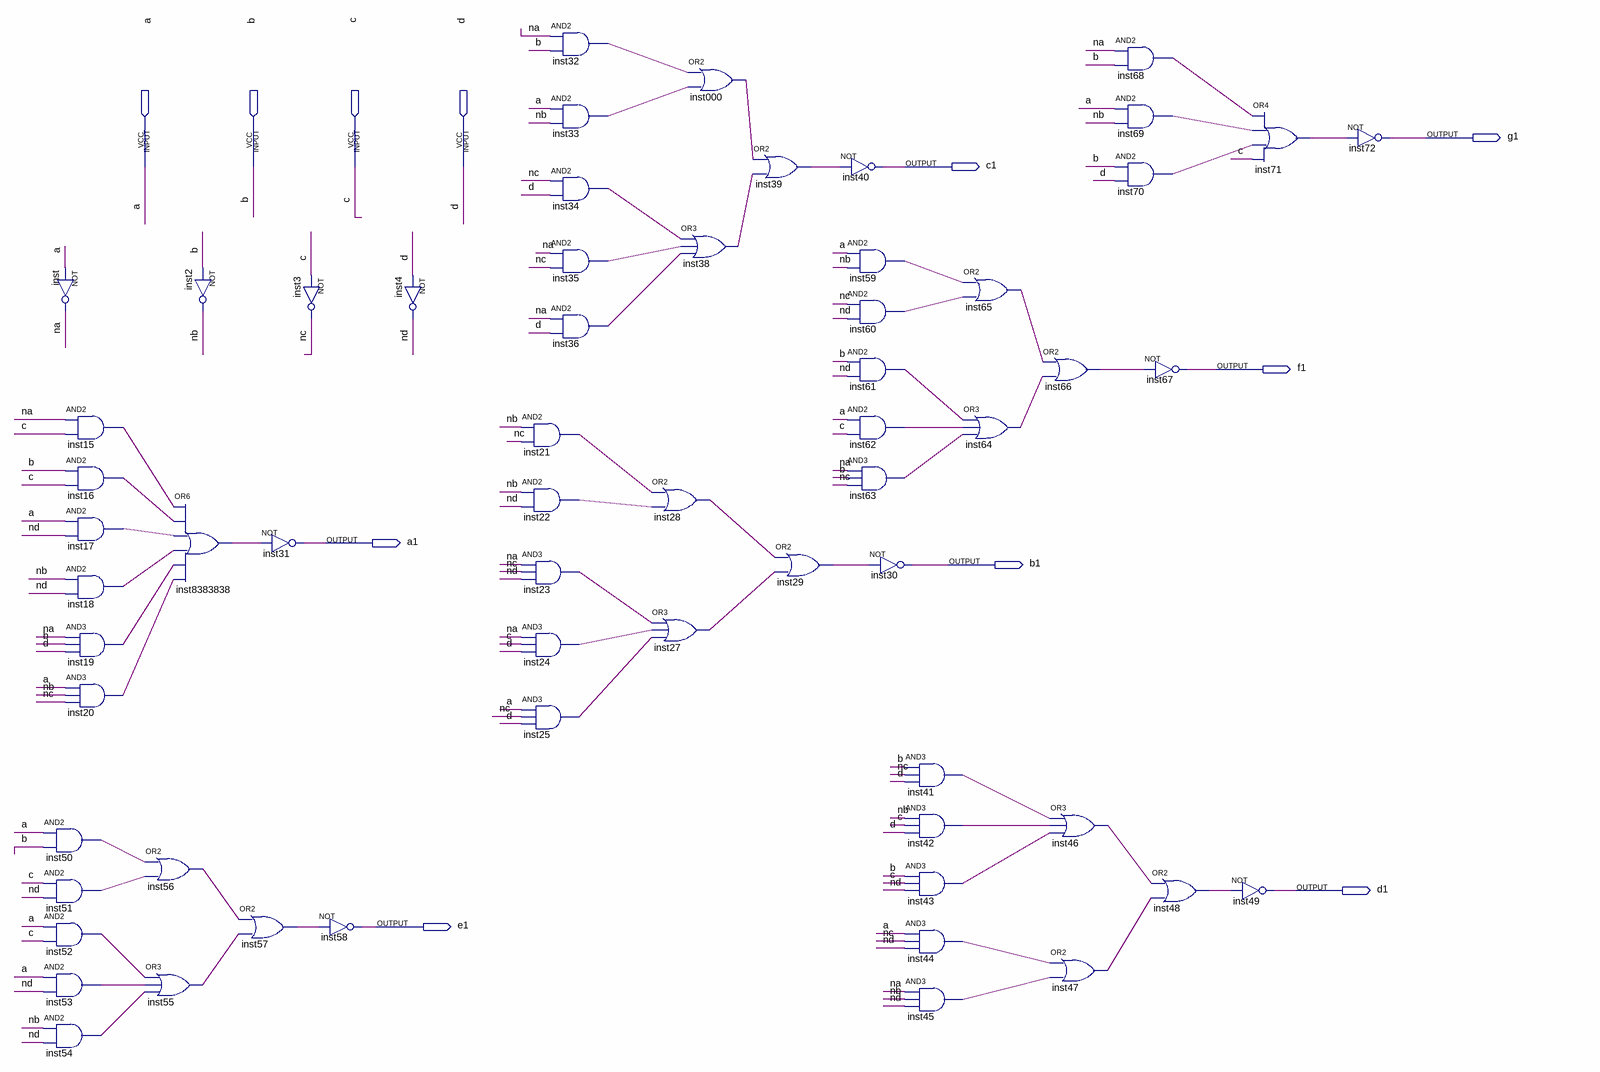
[diagram p0: schematic sheet]
// Quartus schematic Block1.bdf as structural Verilog: 62 symbols, 11 pins
module Block1 (
  input  a,
  input  b,
  input  c,
  input  d,
  output g1,
  output c1,
  output f1,
  output a1,
  output b1,
  output d1,
  output e1
);

  wire inst000_out, inst15_out, inst16_out, inst17_out, inst18_out, inst19_out, inst20_out, inst21_out,
       inst22_out, inst23_out, inst24_out, inst25_out, inst27_out, inst28_out, inst29_out, inst32_out,
       inst33_out, inst34_out, inst35_out, inst36_out, inst38_out, inst39_out, inst41_out, inst42_out,
       inst43_out, inst44_out, inst45_out, inst46_out, inst47_out, inst48_out, inst50_out, inst51_out,
       inst52_out, inst53_out, inst54_out, inst55_out, inst56_out, inst57_out, inst59_out, inst60_out,
       inst61_out, inst62_out, inst63_out, inst64_out, inst65_out, inst66_out, inst68_out, inst69_out,
       inst70_out, inst71_out, inst8383838_out, na, nb, nc, nd;

  not inst (na, a);
  and inst15 (inst15_out, na, c);
  and inst16 (inst16_out, b, c);
  and inst17 (inst17_out, a, nd);
  and inst18 (inst18_out, nb, nd);
  and inst19 (inst19_out, na, b, d);
  and inst20 (inst20_out, a, nb, nc);
  and inst50 (inst50_out, a, b);
  and inst51 (inst51_out, c, nd);
  and inst52 (inst52_out, a, c);
  and inst53 (inst53_out, a, nd);
  and inst54 (inst54_out, nb, nd);
  or inst8383838 (inst8383838_out, inst15_out, inst16_out, inst17_out, inst18_out, inst19_out, inst20_out);
  or inst56 (inst56_out, inst50_out, inst51_out);
  or inst55 (inst55_out, inst52_out, inst53_out, inst54_out);
  not inst2 (nb, b);
  or inst57 (inst57_out, inst56_out, inst55_out);
  not inst3 (nc, c);
  not inst31 (a1, inst8383838_out);
  not inst58 (e1, inst57_out);
  not inst4 (nd, d);
  and inst21 (inst21_out, nb, nc);
  and inst22 (inst22_out, nb, nd);
  and inst23 (inst23_out, na, nc, nd);
  and inst24 (inst24_out, na, c, d);
  and inst25 (inst25_out, a, nc, d);
  and inst32 (inst32_out, na, b);
  and inst33 (inst33_out, a, nb);
  and inst34 (inst34_out, nc, d);
  and inst35 (inst35_out, na, nc);
  and inst36 (inst36_out, na, d);
  or inst000 (inst000_out, inst32_out, inst33_out);
  or inst38 (inst38_out, inst34_out, inst35_out, inst36_out);
  or inst28 (inst28_out, inst21_out, inst22_out);
  or inst27 (inst27_out, inst23_out, inst24_out, inst25_out);
  or inst39 (inst39_out, inst000_out, inst38_out);
  or inst29 (inst29_out, inst28_out, inst27_out);
  not inst40 (c1, inst39_out);
  and inst59 (inst59_out, a, nb);
  and inst60 (inst60_out, nc, nd);
  and inst61 (inst61_out, b, nd);
  and inst62 (inst62_out, a, c);
  and inst63 (inst63_out, na, b, nc);
  not inst30 (b1, inst29_out);
  and inst41 (inst41_out, b, nc, d);
  and inst42 (inst42_out, nb, c, d);
  and inst43 (inst43_out, b, c, nd);
  and inst44 (inst44_out, a, nc, nd);
  and inst45 (inst45_out, na, nb, nd);
  or inst65 (inst65_out, inst59_out, inst60_out);
  or inst64 (inst64_out, inst61_out, inst62_out, inst63_out);
  or inst66 (inst66_out, inst65_out, inst64_out);
  or inst46 (inst46_out, inst41_out, inst42_out, inst43_out);
  or inst47 (inst47_out, inst44_out, inst45_out);
  and inst68 (inst68_out, na, b);
  and inst69 (inst69_out, a, nb);
  and inst70 (inst70_out, b, d);
  not inst67 (f1, inst66_out);
  or inst48 (inst48_out, inst46_out, inst47_out);
  or inst71 (inst71_out, inst68_out, inst69_out, inst70_out, c);
  not inst49 (d1, inst48_out);
  not inst72 (g1, inst71_out);
endmodule
